# Altium project zigbee-coordinator-router.PrjPcb
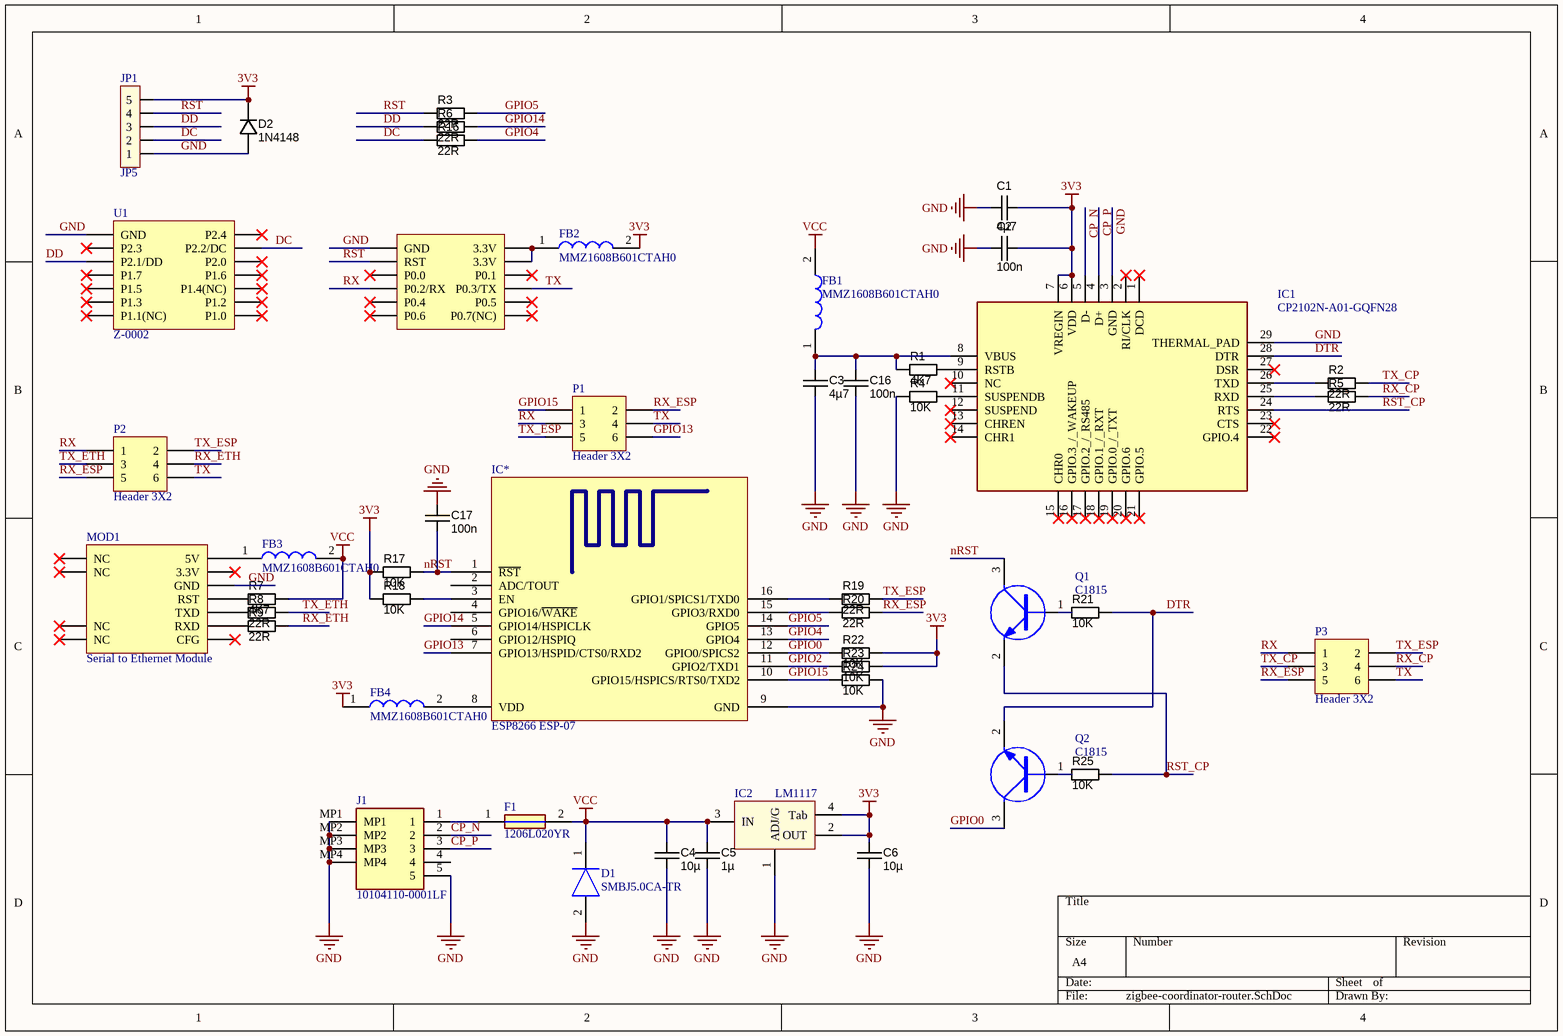
[diagram p0: zigbee-coordinator-router.SchDoc]
2 sheets, 75 parts. Net scope: global (net labels, ports and power ports of the same name join across sheets).
Board file: zigbee-coordinator-router.PcbDoc
Sheets:
  zigbee-coordinator-router.SchDoc
  RS485.SchDoc

## Sheet zigbee-coordinator-router.SchDoc
size A4

### Parts
C1  value 4µ7  [CAPC2012N]  (hidden comment: approved sub OK)
C2  value 100n  [CAPC1608N]  (hidden comment: approved sub OK)
C3  value 4µ7  [CAPC2012N]  (hidden comment: approved sub OK)
C4  value 10µ  [CAPC2012N]  (hidden comment: approved sub OK)
C5  value 1µ  [CAPC1608N]  (hidden comment: approved sub OK)
C6  value 10µ  [CAPC2012N]  (hidden comment: approved sub OK)
C16  value 100n  [CAPC1608N]  (hidden comment: approved sub OK)
C17  value 100n  [CAPC1608N]  (hidden comment: approved sub OK)
D1  SMBJ5.0CA-TR  [SMBJ36CATR]
D2  1N4148  [SOD523F]
F1  1206L020YR  [FUSC3216X100N]
FB1  MMZ1608B601CTAH0  [BEADC1608X95N]
FB2  MMZ1608B601CTAH0  [BEADC1608X95N]
FB3  MMZ1608B601CTAH0  [BEADC1608X95N]
FB4  MMZ1608B601CTAH0  [BEADC1608X95N]
IC1  CP2102N-A01-GQFN28  [QFN50P500X500X80-29N-D]
IC2  LM1117  [SOT223-4N]
IC*  ESP8266 ESP-07  [ESP8266 ESP-07]
J1  10104110-0001LF  [101041100001LF]
JP1  JP5  [JP5]
MOD1  Serial to Ethernet Module  [USR-TCP232-T2]
P1  Header 3X2  [HDR2X3]
P2  Header 3X2  [HDR2X3]
P3  Header 3X2  [HDR2X3]
Q1  C1815  [SOT23]
Q2  C1815  [SOT23]
R1  value 4K7  [RESC1608N]  (hidden comment: Thick Film)
R2  value 22R  [RESC1608N]  (hidden comment: Thick Film)
R3  value 22R  [RESC1608N]  (hidden comment: Thick Film)
R4  value 10K  [RESC1608N]  (hidden comment: Thick Film)
R5  value 22R  [RESC1608N]  (hidden comment: Thick Film)
R6  value 22R  [RESC1608N]  (hidden comment: Thick Film)
R7  value 4K7  [RESC1608N]  (hidden comment: Thick Film)
R8  value 22R  [RESC1608N]  (hidden comment: Thick Film)
R9  value 22R  [RESC1608N]  (hidden comment: Thick Film)
R16  value 22R  [RESC1608N]  (hidden comment: Thick Film)
R17  value 10K  [RESC1608N]  (hidden comment: Thick Film)
R18  value 10K  [RESC1608N]  (hidden comment: Thick Film)
R19  value 22R  [RESC1608N]  (hidden comment: Thick Film)
R20  value 22R  [RESC1608N]  (hidden comment: Thick Film)
R21  value 10K  [RESC1608N]  (hidden comment: Thick Film)
R22  value 10K  [RESC1608N]  (hidden comment: Thick Film)
R23  value 10K  [RESC1608N]  (hidden comment: Thick Film)
R24  value 10K  [RESC1608N]  (hidden comment: Thick Film)
R25  value 10K  [RESC1608N]  (hidden comment: Thick Film)
U1  Z-0002  [Z-0002]

### Nets
3V3: C1.1 C2.1 C6.1 D2.K FB2.2 FB4.1 IC1.6(VDD) IC1.7(VREGIN) IC2.2(OUT) IC2.4(Tab) JP1.5 R17.1 R18.1 R22.2 R23.2
GND: C1.2 C2.2 C3.2 C4.2 C5.2 C6.2 C16.2 C17.2 D1.2(A) D2.A IC1.3(GND) IC1.29(THERMAL_PAD) IC2.1(ADJ/G) IC*.9(GND) J1.5 J1.MP1 J1.MP2 J1.MP3 J1.MP4 JP1.1 MOD1.3(GND) R4.1 R24.2 U1.1(GND) U1.15(GND)
VCC: C4.1 C5.1 D1.1(K) F1.2 FB1.2 FB3.2 IC2.3(IN) R7.2
CP_N: IC1.5(D-) J1.2
CP_P: IC1.4(D+) J1.3
DC: JP1.2 R16.1 U1.4(P2.2/DC)
DD: JP1.3 R6.1 U1.5(P2.1/DD)
DTR: IC1.28(DTR) Q2.2(E) R21.2
GPIO0: IC*.12(GPIO0/SPICS2) Q2.3(C) R22.1
GPIO2: IC*.11(GPIO2/TXD1) R23.1
GPIO4: IC*.13(GPIO4) R16.2
GPIO5: IC*.14(GPIO5) R3.2
GPIO13: IC*.7(GPIO13/HSPID/CTS0/RXD2) P1.6
GPIO14: IC*.5(GPIO14/HSPICLK) R6.2
GPIO15: IC*.10(GPIO15/HSPICS/RTS0/TXD2) P1.1 R24.1
nRST: C17.1 IC*.1(~{RST}) Q1.3(C) R17.2
RST: JP1.4 R3.1 U1.17(RST)
RST_CP: IC1.24(RTS) Q1.2(E) R25.2
RX: P1.3 P2.1 P3.1 U1.21(P0.2/RX)
RX_CP: P3.4 R5.2
RX_ESP: P1.2 P2.5 P3.5 R20.2
RX_ETH: P2.4 R9.2
TX: P1.4 P2.6 P3.6 U1.22(P0.3/TX)
TX_CP: P3.3 R2.2
TX_ESP: P1.5 P2.2 P3.2 R19.2
TX_ETH: P2.3 R8.2
NetC3_1: C3.1 C16.1 FB1.1 IC1.8(VBUS) R1.1
NetF1_1: F1.1 J1.1
NetFB2_1: FB2.1 U1.16(3.3V) U1.18(3.3V)
NetFB3_1: FB3.1 MOD1.1(5V)
NetFB4_2: FB4.2 IC*.8(VDD)
NetIC1_9: IC1.9(RSTB) R1.2
NetIC1_11: IC1.11(SUSPENDB) R4.2
NetIC1_25: IC1.25(RXD) R5.1
NetIC1_26: IC1.26(TXD) R2.1
NetIC*_3: IC*.3(EN) R18.2
NetIC*_15: IC*.15(GPIO3/RXD0) R20.1
NetIC*_16: IC*.16(GPIO1/SPICS1/TXD0) R19.1
NetMOD1_4: MOD1.4(RST) R7.1
NetMOD1_5: MOD1.5(TXD) R8.1
NetMOD1_6: MOD1.6(RXD) R9.1
NetQ1_1: Q1.1(B) R21.1
NetQ2_1: Q2.1(B) R25.1

Not connected (* = marked no-connect by the designer): IC1 1(DCD)* 2(RI/CLK)* 10(NC)* 12(SUSPEND)* 13(CHREN)* 14(CHR1)* 15(CHR0)* 16(GPIO.3_/_WAKEUP)* 17(GPIO.2_/_RS485)* 18(GPIO.1_/_RXT)* 19(GPIO.0_/_TXT)* 20(GPIO.6)* 21(GPIO.5)* 22(GPIO.4)* 23(CTS)* 27(DSR)*; IC* 2(ADC/TOUT) 4(GPIO16/~{WAKE}) 6(GPIO12/HSPIQ); J1 4; MOD1 0(NC)* 2(3.3V)* 7(CFG)*; U1 2(P2.4)* 3(P2.3)* 6(P2.0)* 7(P1.7)* 8(P1.6)* 9(P1.5)* 10(P1.4(NC))* 11(P1.3)* 12(P1.2)* 13(P1.1(NC))* 14(P1.0)* 19(P0.0)* 20(P0.1)* 23(P0.4)* 24(P0.5)* 25(P0.6)* 26(P0.7(NC))*

### Library data of the parts
C1 C3 = CAPC_4u7_0805: Capacitor SMD Cer 4.7uF 10% 16V X5R 0805; Manufacturer 1: Taiyo Yuden; Manufacturer Part Number 1: EMK212BJ475KG-T; Ratings: 16V; X5R; Material: ceramic; Package / Case: 0805 (2012 Metric); Tolerance: ±10%; Supplier 1: Digi-Key; Supplier Part Number 1: 587-1294-1-ND; Operating Temperature: -55°C ~ 85°C; Size / Dimension: 0.079" L x 0.049" W (2.00mm x 1.25mm); Thickness (Max): 0.053" (1.35mm); ComponentLink1URL: http://www.yuden.co.jp/productdata/catalog/en/mlcc01_e.pdf; ComponentLink1Description: http://www.yuden.co.jp/productdata/catalog/en/mlcc01_e.pdf
C2 C16 C17 = CAPC_100n_0603: Capacitor SMD Cer 100nF 10% 50V X7R 0603; Manufacturer 1: AVX Corporation; Manufacturer Part Number 1: 06035C104KAT2A; Ratings: 50V; X7R; Material: ceramic; Manufacturer 2: TDK Corporation; Manufacturer Part Number 2: C1608X7R1H104K; Package / Case: 0603 (1608 Metric); Tolerance: ±10%; Supplier 1: Digi-Key; Supplier Part Number 1: 478-5052-1-ND; ComponentLink1URL: http://www.avx.com/docs/Catalogs/cx7r.pdf; ComponentLink1Description: http://www.avx.com/docs/Catalogs/cx7r.pdf; Supplier 2: Digi-Key; Supplier Part Number 2: 445-1314-1-ND; ComponentLink2URL: http://product.tdk.com/capacitor/mlcc/en/documents/mlcc_commercial_general_en.pdf; ComponentLink2Description: http://product.tdk.com/capacitor/mlcc/en/documents/mlcc_commercial_general_en.pdf
C4 C6 = CAPC_10u_0805_16V: Capacitor SMD Cer 10uF 10% 16V X7R 0805; Manufacturer 1: Samsung; Manufacturer Part Number 1: CL21B106KBN; Ratings: 16V; X7R; Material: ceramic; Package / Case: 0805 (2012 metric); Tolerance: ±10%
C5 = CAPC_1u_0603: Capacitor SMD Cer 1uF 10% 16V X7R 0603; Manufacturer 1: TDK Corporation; Manufacturer Part Number 1: C1608X7R1C105K; Ratings: 16V; X7R; Material: ceramic; Package / Case: 0603 (1608 metric); Tolerance: ±10%; Supplier 1: Digi-Key; Supplier Part Number 1: 445-1604-1-ND
D1 = SMBJ5.0CA-TR: Diode; Manufacturer_Name: STMicroelectronics; Datasheet Link: http://www.st.com/web/en/resource/technical/document/datasheet/CD00001366.pdf; Height: 2.65mm; Manufacturer_Part_Number: SMBJ5.0CA-TR; Arrow Part Number: SMBJ5.0CA-TR; Arrow Price/Stock: https://www.arrow.com/en/products/smbj5.0ca-tr/stmicroelectronics; Mouser Part Number: 511-SMBJ5.0CA; Mouser Price/Stock: https://www.mouser.co.uk/ProductDetail/STMicroelectronics/SMBJ50CA-TR?qs=tER8mgMWkVzBeTa24vhQbA%3D%3D
D2 = DIODE_1N4148_200mA_SOD523F: Diode SMD small signal 0.2A SOD-523F; Ratings: Vr=75V; Vf=1V@10mA; Io=200mA; Material: Si; Package / Case: SC-79, SOD-523F; Supplier 1: Digi-Key; Supplier Part Number 1: 1N4148WTCT-ND; Value: 1N4148
F1 = 1206L020YR: Fuse; Manufacturer_Name: LITTELFUSE; Datasheet Link: https://m.littelfuse.com/~/media/electronics/datasheets/resettable_ptcs/littelfuse_ptc_1206l_datasheet.pdf.pdf; Height: 1mm; Manufacturer_Part_Number: 1206L020YR; Arrow Part Number: 1206L020YR; Arrow Price/Stock: https://www.arrow.com/en/products/1206l020yr/littelfuse; Mouser Part Number: 576-1206L020YR; Mouser Price/Stock: https://www.mouser.com/Search/Refine.aspx?Keyword=576-1206L020YR
FB1-FB4 = MMZ1608B601CTAH0: Ferrite Bead; Manufacturer_Name: TDK; Datasheet Link: https://product.tdk.com/info/en/catalog/datasheets/beads_commercial_signal_mmz1608_en.pdf; Height: 0.95mm; Manufacturer_Part_Number: MMZ1608B601CTAH0; Arrow Part Number: MMZ1608B601CTAH0; Arrow Price/Stock: https://www.arrow.com/en/products/mmz1608b601ctah0/tdk; Mouser Part Number: 810-MMZ1608B601CTAH0; Mouser Price/Stock: https://www.mouser.co.uk/ProductDetail/TDK/MMZ1608B601CTAH0?qs=8Kz9Wu9QwqX2rZ3grlLL0Q%3D%3D
IC1 = CP2102N-A01-GQFN28: Integrated Circuit; Manufacturer_Name: Silicon Labs; Datasheet Link: http://www.farnell.com/datasheets/2245279.pdf; Height: 0.8mm; Manufacturer_Part_Number: CP2102N-A01-GQFN28; Arrow Part Number: CP2102N-A01-GQFN28; Arrow Price/Stock: https://www.arrow.com/en/products/cp2102n-a01-gqfn28/silicon-labs; Mouser Part Number: 634-CP2102NA01GQFN28; Mouser Price/Stock: https://www.mouser.co.uk/ProductDetail/Silicon-Labs/CP2102N-A01-GQFN28?qs=%252BaFUgn%2FzHmxGRIXZFn%252Btdg%3D%3D
IC2 = LM1117: 3v3; Value: LM317
J1 = 10104110-0001LF: Connector; Manufacturer_Name: Amphenol; Datasheet Link: https://componentsearchengine.com/Datasheets/1/10104110-0001LF.pdf; Height: 2.98mm; Manufacturer_Part_Number: 10104110-0001LF; Arrow Part Number: 10104110-0001LF; Arrow Price/Stock: https://www.arrow.com/en/products/10104110-0001lf/amphenol-fci; Mouser Part Number: 649-10104110-0001LF; Mouser Price/Stock: https://www.mouser.co.uk/ProductDetail/Amphenol-FCI/10104110-0001LF?qs=3wMSRtz0%252BRoQF1VV4tle7w%3D%3D
MOD1 = USR-TCP232-T2
P1-P3 = Header 3X2: Header, 3-Pin, Dual row; LatestRevisionDate: 17-Jul-2002; LatestRevisionNote: Re-released for DXP Platform.; Publisher: Altium Limited
Q1 Q2 = C1815: NPN 600mW, ECB; Value: C1815
R1 R7 = RES_4K7_0603_5%: Resistor SMD chip 4.7k Ohm 0.1W 5% 0603; Manufacturer 1: Vishay/Dale; Manufacturer Part Number 1: CRCW06034K70JNEA; Ratings: 1/10 W; Package / Case: 0603 (1608 metric); Tolerance: ±5%; Material: Thick Film; Supplier 1: Digi-Key; Supplier Part Number 1: 541-4.7KGCT-ND
R2 R3 R5 R6 R8 R9 R16 R19 R20 = RES_22R_0603_5%: Resistor SMD chip 22 Ohm 0.1W 5% 0603; Manufacturer 1: Yageo; Manufacturer Part Number 1: RC0603JR-0722RL; Ratings: 1/10W; Tolerance: ±5%; Package / Case: 0603 (1608 metric); Case: 0603 (1608 metric); Supplier 1: Digi-Key; Supplier Part Number 1: 311-22GRCT-ND
R4 R17 R18 R21-R25 = RES_10K_0603_5%: Resistor SMD chip 10k Ohm 0.1W 5% 0603; Manufacturer 1: Yageo; Manufacturer Part Number 1: RC0603JR-0710KL; Ratings: 1/10 W; Package / Case: 0603 (1608 metric); Tolerance: ±5%; Supplier 1: Digi-Key; Supplier Part Number 1: 311-10KGRCT-ND

## Sheet RS485.SchDoc
size A
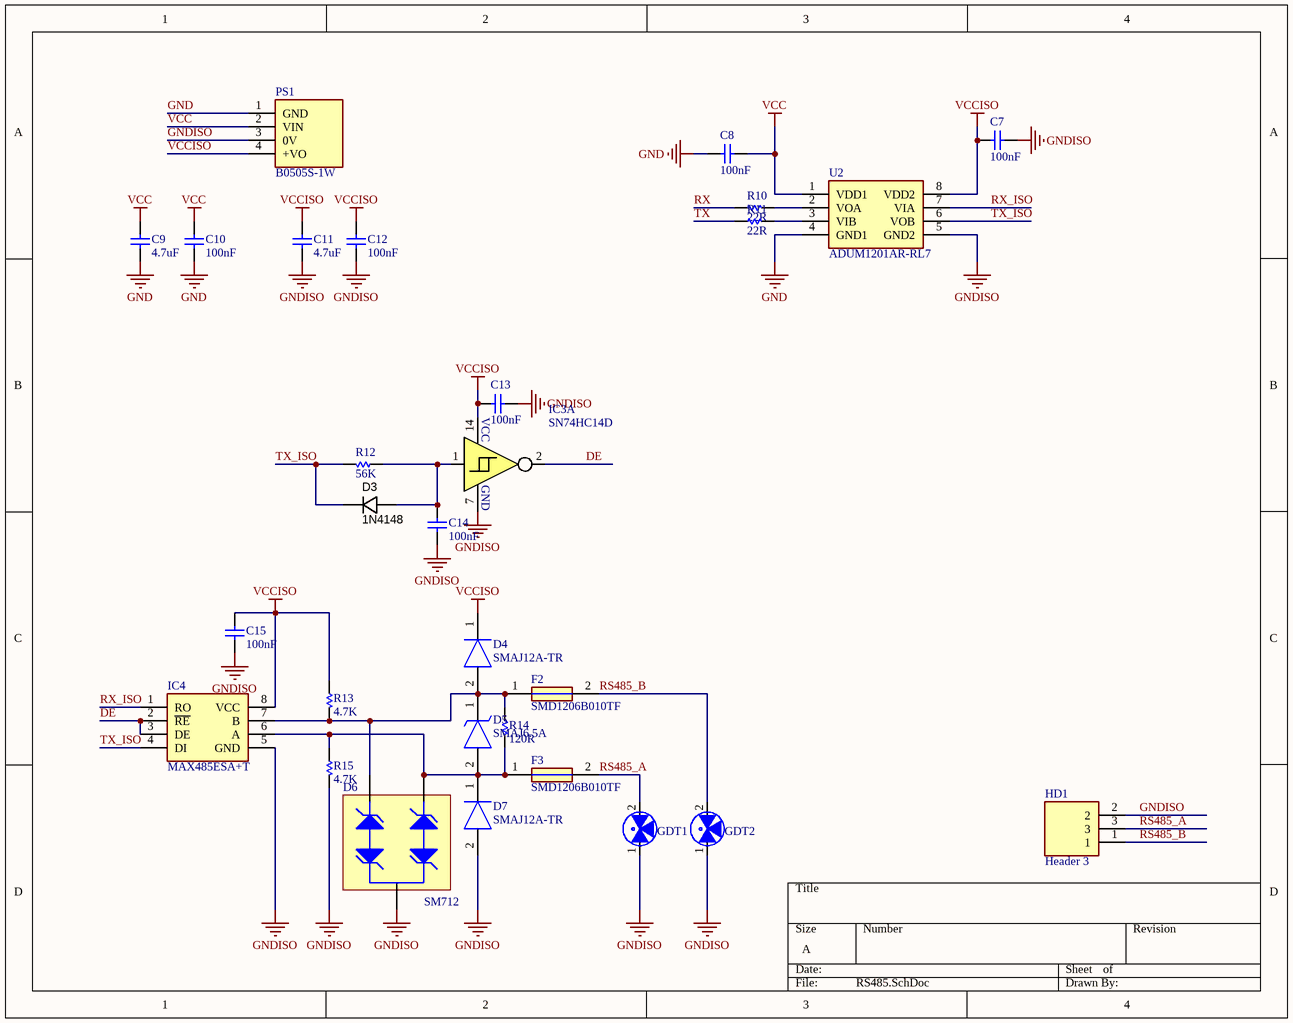
[diagram p1: RS485.SchDoc]

### Parts
C7  100nF  [CAP-0603-Standard]
C8  100nF  [CAP-0603-Standard]
C9  4.7uF  [CAP-0603-Standard]
C10  100nF  [CAP-0603-Standard]
C11  4.7uF  [CAP-0603-Standard]
C12  100nF  [CAP-0603-Standard]
C13  100nF  [CAP-0603-Standard]
C14  100nF  [CAP-0603-Standard]
C15  100nF  [CAP-0603-Standard]
D3  1N4148  [SOD523F]
D4  SMAJ12A-TR  [DIOM5126X265N]
D5  SMAJ6.5A  [DIOM5026X229N]
D6  SM712  [SOT23]
D7  SMAJ12A-TR  [DIOM5126X265N]
F2  SMD1206B010TF  [FUSC3216X100N]
F3  SMD1206B010TF  [FUSC3216X100N]
GDT1  2RL150M-5  [2R-5-ST5]  (value not drawn)
GDT2  2RL150M-5  [2R-5-ST5]  (value not drawn)
HD1  Header 3  [SHDRRA3W80P0X381_1X3_1190X920X720P]
IC3  SN74HC14D  [SOIC127P600X175-14N]  (part A of 6)
IC4  MAX485ESA+T  [SOIC127P600X175-8N]
PS1  B0505S-1W  [B0505S1W]
R10  22R  [RES-0603-STANDARD]
R11  22R  [RES-0603-STANDARD]
R12  56K  [RES-0603-STANDARD]
R13  4.7K  [RES-0603-STANDARD]
R14  120R  [RES-0603-STANDARD]
R15  4.7K  [RES-0603-STANDARD]
U2  ADUM1201AR-RL7  [SOIC127P600X175-8N]

### Nets
GND: C8.2 C9.2 C10.2 PS1.1(GND) U2.4(GND1)
GNDISO: C7.1 C11.2 C12.2 C13.1 C14.2 C15.1 D6.3 D7.2(A) GDT1.1 GDT2.1 HD1.2 IC3.7(GND) IC4.5(GND) PS1.3(0V) R15.2 U2.5(GND2)
VCC: C8.1 C9.1 C10.1 PS1.2(VIN) U2.1(VDD1)
VCCISO: C7.2 C11.1 C12.1 C13.2 C15.2 D4.1(K) IC3.14(VCC) IC4.8(VCC) PS1.4(+VO) R13.1 U2.8(VDD2)
DE: IC3.2(1Y) IC4.2(~{RE}) IC4.3(DE)
RS485_A: F3.2 GDT1.2 HD1.3
RS485_B: F2.2 GDT2.2 HD1.1
RX: R10.1
RX_ISO: IC4.1(RO) U2.7(VIA)
TX: R11.1
TX_ISO: D3.K IC4.4(DI) R12.2 U2.6(VOB)
NetC14_1: C14.1 D3.A IC3.1(1A) R12.1
NetD4_2: D4.2(A) D5.1(K) D6.2 F2.1 IC4.7(B) R13.2 R14.1
NetD5_2: D5.2(A) D6.1 D7.1(K) F3.1 IC4.6(A) R14.2 R15.1
NetR10_2: R10.2 U2.2(VOA)
NetR11_2: R11.2 U2.3(VIB)

### Library data of the parts
C7 C8 C10 C12-C15 = CAP-0603-0.1uF: CAP-CER, SMD, 0603, 0.1UF; Manufacturer: AVX; Manufacturer Part Number: 06031C104JAT2A; Tolerance: ±5%; Voltage - Rated: 100V; Operating Temperature: -55°C ~ 125°C; Package / Case: 0603 (1608 Metric); Distributor: Mouser; Price: 0.66; Capacitance: 100nF
C9 C11 = CAP-0603-0.1uF: CAP-CER, SMD, 0603, 4.7UF, 5%, 100V; Manufacturer: AVX; Manufacturer Part Number: 06031C104JAT2A; Tolerance: ±5%; Operating Temperature: -55°C ~ 125°C; Package / Case: 0603 (1608 Metric); Voltage - Rated: 100V; Distributor: Mouser; Price: 0.66; Capacitance: 4.7uF
D3 = DIODE_1N4148_200mA_SOD523F: as D2 on sheet zigbee-coordinator-router; Package / Case: SC-79, SOD-523F; Supplier 1: Digi-Key; Supplier Part Number 1: 1N4148WTCT-ND; Value: 1N4148
D4 D7 = SMAJ12A-TR: Diode; Manufacturer_Name: STMicroelectronics; Datasheet Link: http://www.st.com/web/en/resource/technical/document/datasheet/CD00001333.pdf; Height: 2.65mm; Manufacturer_Part_Number: SMAJ12A-TR; Arrow Part Number: SMAJ12A-TR; Arrow Price/Stock: https://www.arrow.com/en/products/smaj12a-tr/stmicroelectronics; Mouser Part Number: 511-SMAJ12A-TR; Mouser Price/Stock: https://www.mouser.co.uk/ProductDetail/STMicroelectronics/SMAJ12A-TR?qs=WkDnCMkPR9d1rwo9apkNUw%3D%3D
D5 = SMAJ6.5A: TVS Diode (Uni-directional); Manufacturer_Name: LITTELFUSE; Datasheet Link: https://4donline.ihs.com/images/VipMasterIC/IC/LFSI/LFSI-S-A0001360630/LFSI-S-A0001360630-1.pdf?hkey=52A5661711E402568146F3353EA87419; Height: 2.29mm; Manufacturer_Part_Number: SMAJ6.5A; Arrow Part Number: SMAJ6.5A; Arrow Price/Stock: https://www.arrow.com/en/products/smaj6.5a/littelfuse; Mouser Part Number: 576-SMAJ6.5A; Mouser Price/Stock: https://www.mouser.co.uk/ProductDetail/Littelfuse/SMAJ65A?qs=zHiv0nsVGmpL0b0CmH5SeA%3D%3D
D6 = CDSOT23-SM712: TVS DIODE 7VWM/12VWM SOT23; Manufacturer: Bourns Inc.; Type: Zener; Voltage - Reverse Standoff (Typ): 7V (Max), 12V (Max); Voltage - Breakdown (Min): 7.5V, 13.3V; Voltage - Clamping (Max) @ Ipp: 14V, 26V; Current - Peak Pulse (10/1000µs): 17A (8/20µs); Power - Peak Pulse: 400W; Power Line Protection: No; Capacitance @ Frequency: 75pF @ 1MHz; Supplier 1: Digi-Key; Manufacturer Part Number: CDSOT23-SM712; RoHS: RoHS Compliant; Category: Circuit Protection; Stock 1: 74145; Pricing 1: 1=1.62, 10=1.437, 25=1.298, 100=1.1356, 250=0.99652, 500=0.88066, 1000=0.69525 (USD); Packaging: Cut Tape (CT); Part Status: Active; Applications: RS-485; Operating Temperature: -55°C ~ 150°C (TJ); Mounting Type: Surface Mount; Package / Case: TO-236-3, SC-59, SOT-23-3; Supplier Device Package: SOT-23-3; ComponentLink1URL: http://www.bourns.com/docs/Product-Datasheets/CDSOT23-SM712.pdf; ComponentLink1Description: http://www.bourns.com/docs/Product-Datasheets/CDSOT23-SM712.pdf; Supplier Part Number 1: CDSOT23-SM712CT-ND
F2 F3 = 1206L020YR: Fuse; Manufacturer_Name: LITTELFUSE; Datasheet Link: https://m.littelfuse.com/~/media/electronics/datasheets/resettable_ptcs/littelfuse_ptc_1206l_datasheet.pdf.pdf; Height: 1mm; Manufacturer_Part_Number: 1206L020YR; Arrow Part Number: 1206L020YR; Arrow Price/Stock: https://www.arrow.com/en/products/1206l020yr/littelfuse; Mouser Part Number: 576-1206L020YR; Mouser Price/Stock: https://www.mouser.com/Search/Refine.aspx?Keyword=576-1206L020YR
GDT1 GDT2 = 2RL150M-5: GDT 150V 5KA 2 POLE SMD
HD1 = Header 3: Terminal Block Header, 3, 300 V, 12 A, 3.81 mm; Manufacturer_Name: Amphenol; Manufacturer_Part_Number: 20020110-D031A01LF; Datasheet Link: http://uk.rs-online.com/web/p/products/7075216; Height: 7.2mm; Arrow Part Number: 20020110-D031A01LF; Arrow Price/Stock: https://www.arrow.com/en/products/20020110-d031a01lf/amphenol
IC3 = SN74HC14D_1: Hex Schmitt Trigger
IC4 = MAX485ESA+T: Integrated Circuit; Manufacturer_Name: Maxim Integrated; Datasheet Link: https://datasheets.maximintegrated.com/en/ds/MAX1487-MAX491.pdf; Height: 1.75mm; Manufacturer_Part_Number: MAX485ESA+T; Arrow Part Number: MAX485ESA+T; Mouser Part Number: 700-MAX485ESAT; Mouser Price/Stock: https://www.mouser.co.uk/ProductDetail/Maxim-Integrated/MAX485ESA%2bT?qs=LHmEVA8xxfYXmvxEk%252BFtEg%3D%3D
PS1 = B0505S-1W: Power Supply; Manufacturer_Name: Mornsun; Datasheet Link: https://www.mornsun-power.com/uploads/pdf/B_D-1W.pdf; Height: 10.41mm; Manufacturer_Part_Number: B0505S-1W; Arrow Part Number: B0505S-1W
R10 R11 R13 R15 = RES-0603: RES, SMD, 0603, 5%, 1/10W, THICK FILM; Manufacturer: Yageo; Manufacturer Part Number: AC0603FR-101KL; Tolerance: 1%; Power (Watts): 0.1W, 1/10W; Operating Temperature: -55°C ~ 155°C; Package / Case: 0603 (1608 Metric); Price: 0.1; Distributor: Mouser
  R10 R11: Resistance: 22R
  R13 R15: Resistance: 4.7K
R12 R14 = RES-0603: RES, SMD, 0603, 1%, 1/10W, THICK FILM; Manufacturer: Yageo; Manufacturer Part Number: AC0603FR-101KL; Power (Watts): 0.1W, 1/10W; Operating Temperature: -55°C ~ 155°C; Package / Case: 0603 (1608 Metric); Price: 0.1; Distributor: Mouser; Tolerance: 1%
  R12: Resistance: 56K
  R14: Resistance: 120R
U2 = ADUM1201AR-RL7: Capacitor; Manufacturer_Name: Analog Devices; Datasheet Link: http://www.analog.com/media/en/technical-documentation/data-sheets/ADuM1200_1201.pdf; Height: 1.75mm; Manufacturer_Part_Number: ADUM1201AR-RL7; Arrow Part Number: ADUM1201AR-RL7; Arrow Price/Stock: https://www.arrow.com/en/products/adum1201ar-rl7/analog-devices; Mouser Part Number: 584-ADUM1201AR-R7; Mouser Price/Stock: https://www.mouser.co.uk/ProductDetail/Analog-Devices/ADUM1201AR-RL7?qs=WIvQP4zGangOW4BQdeJ35g%3D%3D

## Nets that join several sheets
GND: zigbee-coordinator-router (25 pins), RS485 (5 pins)
VCC: zigbee-coordinator-router (8 pins), RS485 (5 pins)
RX: zigbee-coordinator-router (P1.3 P2.1 P3.1 U1.21), RS485 (R10.1)
TX: zigbee-coordinator-router (P1.4 P2.6 P3.6 U1.22), RS485 (R11.1)